# EAGLE schematic logic (EAGLE 9.6.2)
Assembly variants: basic

## Sheet 1 of 3: MCU
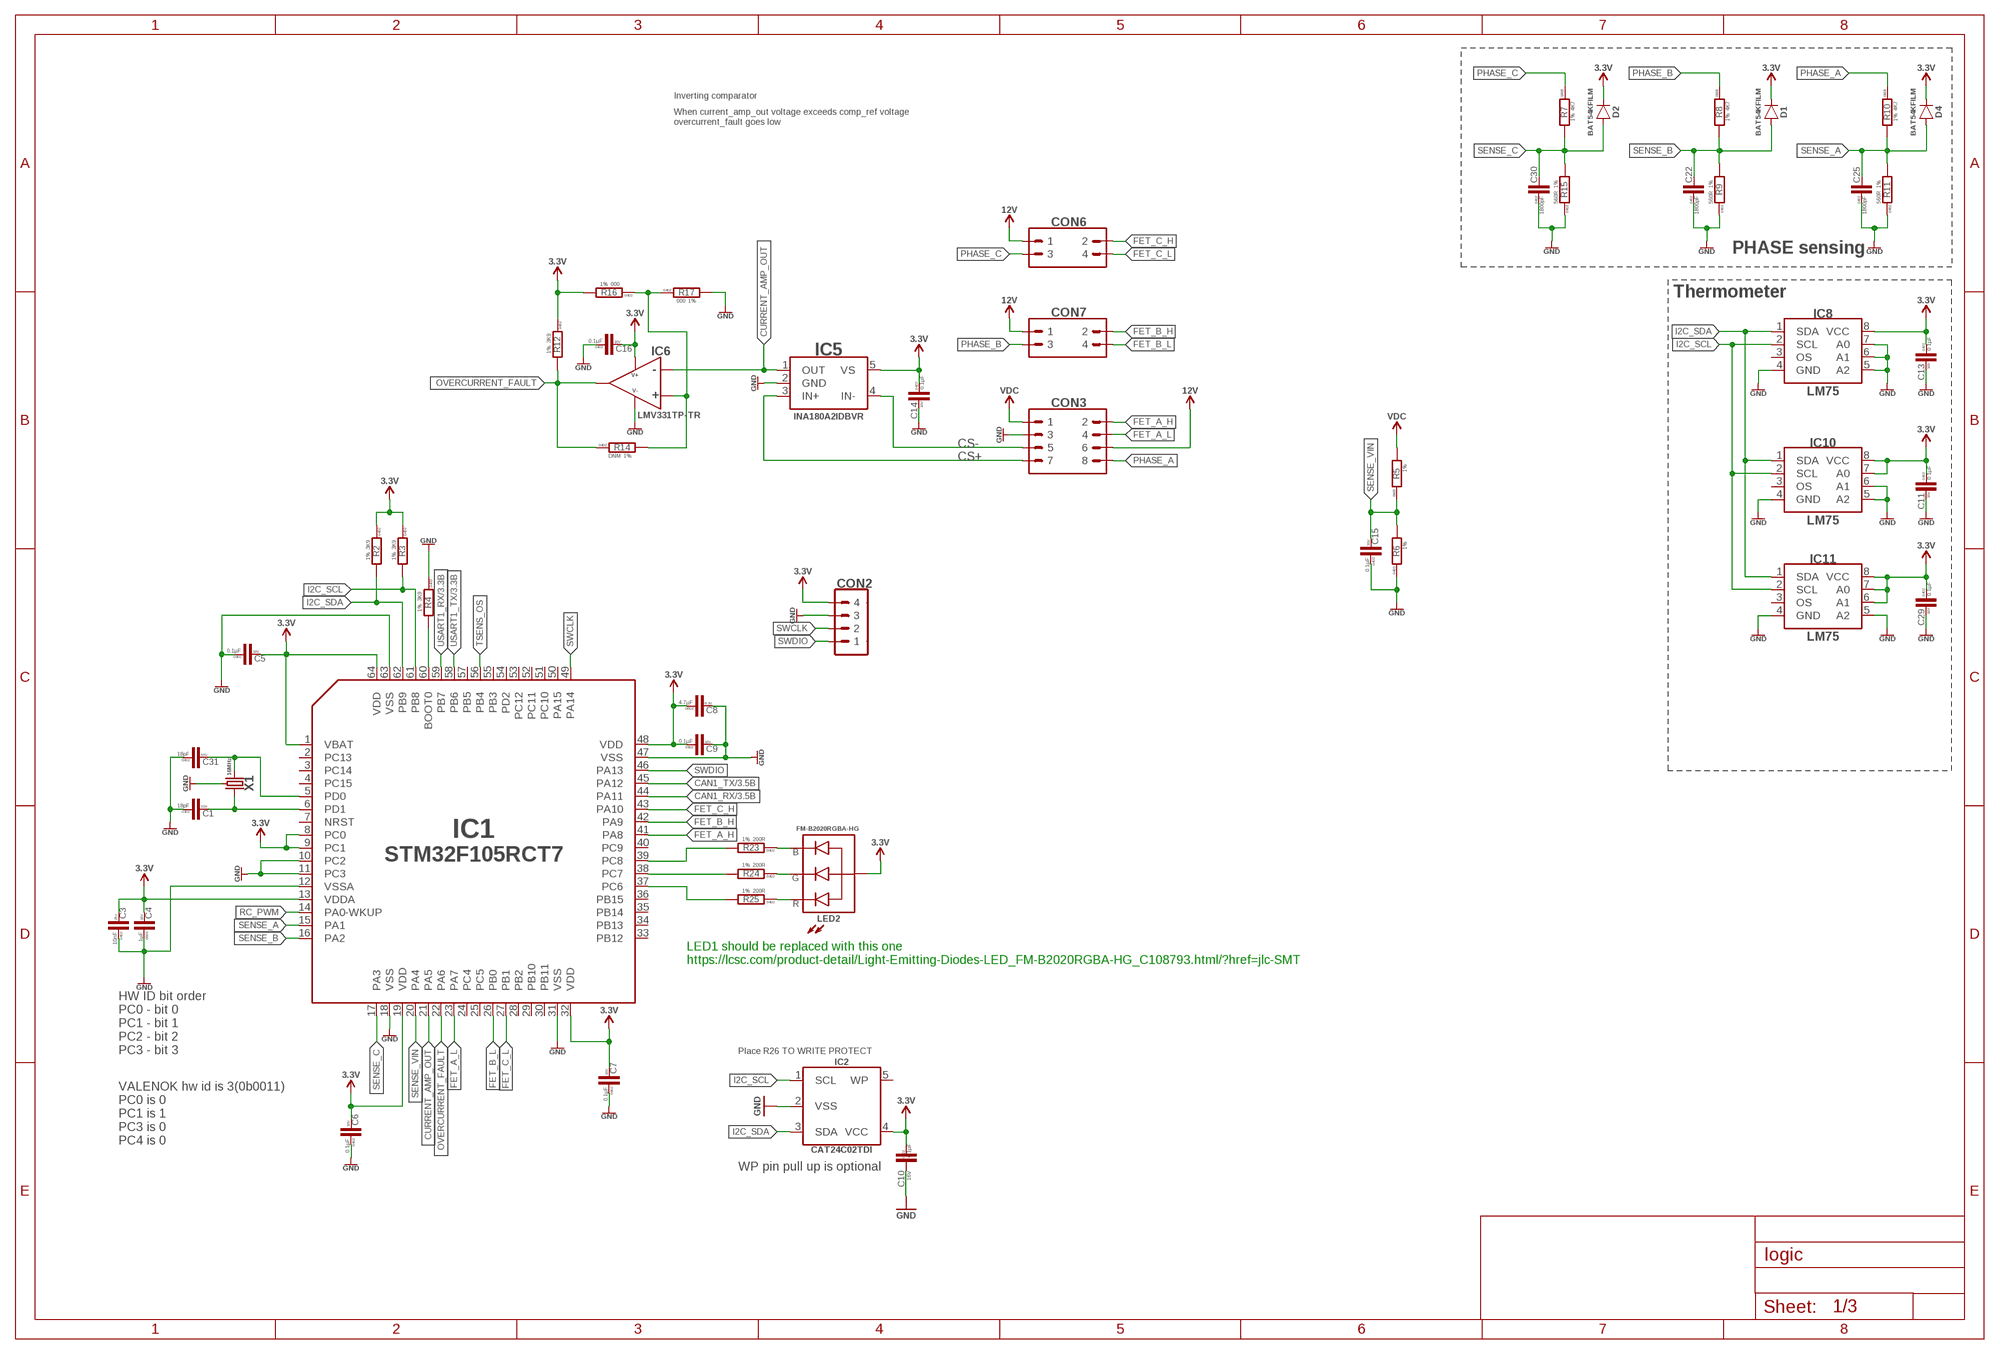
[diagram p0: schematic, sheet 1]

### Parts
C1  18pF  C-0402  [C0402]
C3  10nF  C-0402  [C0402]
C4  1µF  C-0603  [C0603]
C5  0.1µF  C-0402  [C0402]
C6  0.1µF  C-0402  [C0402]
C7  0.1µF  C-0402  [C0402]
C8  4.7µF  C-0603  [C0603]
C9  0.1µF  C-0402  [C0402]
C10  0.1µF  0.1µF-16V_10%_X7R-0402  [C0402]
C11  0.1µF  C-0402  [C0402]
C13  0.1µF  C-0402  [C0402]
C14  0.1µF  C-0402  [C0402]
C15  0.1µF  C-0402  [C0402]
C16  0.1µF  C-0402  [C0402]
C22  1800pF  C-0402  [C0402]
C25  1800pF  C-0402  [C0402]
C29  0.1µF  C-0402  [C0402]
C30  1800pF  C-0402  [C0402]
C31  18pF  C-0402  [C0402]
CON2  PINHEAD_1X04-2.54  [1X04-PTH-2.54]
CON3  PINHEAD_2X04-PLS-2  [2X04-PTH-2]
CON6  PINHEAD_2X02-PTH-2-MALE  [2X02-PTH-2]  (not fitted in variant basic)
CON7  PINHEAD_2X02-PTH-2-MALE  [2X02-PTH-2]  (not fitted in variant basic)
D1  BAT54KFILM  [SOD523]
D2  BAT54KFILM  [SOD523]
D4  BAT54KFILM  [SOD523]
IC1  STM32F105RCT6  [TQFP64]
IC2  CAT24C02  [SOT23-5L]
IC5  INA180A2  [SOT23-5]
IC6  LMV331  [SOT23-5L]
IC8  LM75-TSSOP8  [TSSOP8]
IC10  LM75-TSSOP8  [TSSOP8]
IC11  LM75-TSSOP8  [TSSOP8]
LED2  LED_RGB-2020  [LED2020]
R2  3K9  R-1%-0402  [R0402]
R3  3K9  R-1%-0402  [R0402]
R4  3K9  R-1%-0402  [R0402]
R5  R-1%-0805  [R0805]
R6  R-1%-0402  [R0402]
R7  4K7  R-1%-0805  [R0805]
R8  4K7  R-1%-0805  [R0805]
R9  560R  R-1%-0402  [R0402]
R10  4K7  R-1%-0805  [R0805]
R11  560R  R-1%-0402  [R0402]
R12  3K9  R-1%-0402  [R0402]
R14  DNM  R-1%-0402  [R0402]
R15  560R  R-1%-0402  [R0402]
R16  000  R-1%-0402  [R0402]
R17  000  R-1%-0402  [R0402]
R23  200R  R-1%-0402  [R0402]
R24  200R  R-1%-0402  [R0402]
R25  200R  R-1%-0402  [R0402]
X1  16MHz  CRYSTAL-4P-16MHZ-3.2X2.5  [OSCILLATOR-3.2X2.5-4P]

### Nets
BOOT0: IC1.60(BOOT0) R4.2
CAN1_RX: IC1.44(PA11) ; also sheet 3
CAN1_TX: IC1.45(PA12) ; also sheet 3
CS+: CON3.7 IC5.3(IN+)
CS-: CON3.5 IC5.4(IN-)
CURRENT_AMP_OUT: IC1.21(PA5) IC5.1(OUT) IC6.3(IN-)
FET_A_H: CON3.2 IC1.41(PA8)
FET_A_L: CON3.4 IC1.23(PA7)
FET_B_H: CON7.2 IC1.42(PA9)
FET_B_L: CON7.4 IC1.26(PB0)
FET_C_H: CON6.2 IC1.43(PA10)
FET_C_L: CON6.4 IC1.27(PB1)
GND: C1.1 C3.1 C4.1 C5.1 C6.1 C7.1 C8.2 C9.2 C10.2 C11.2 C13.2 C14.2 C15.1 C16.1 C22.1 C25.1 C29.2 C30.1 C31.1 CON2.3 CON3.3 IC1.10(PC2) IC1.11(PC3) IC1.12(VSSA) IC1.18(VSS) IC1.31(VSS) IC1.47(VSS) IC1.63(VSS) IC2.2(VSS) IC5.2(GND) IC6.2(V-) IC8.4(GND) IC8.5(A2) IC8.6(A1) IC8.7(A0) IC10.4(GND) IC10.5(A2) IC10.6(A1) IC11.4(GND) IC11.5(A2) R4.1 R6.1 R9.1 R11.1 R15.1 R17.2 X1.2(GND) X1.4(GND) ; also sheet 2,3
I2C_SCL: IC1.61(PB8) IC2.1(SCL) IC8.2(SCL) IC10.2(SCL) IC11.2(SCL) R3.2
I2C_SDA: IC1.62(PB9) IC2.3(SDA) IC8.1(SDA) IC10.1(SDA) IC11.1(SDA) R2.2
N$2: IC6.1(IN+) R14.2 R16.1 R17.1
N$3: IC1.37(PC6) R25.2
N$6: LED2.B R23.1
N$7: LED2.R R25.1
N$12: IC1.38(PC7) R24.2
N$16: C31.2 IC1.5(PD0) X1.3
N$18: IC1.39(PC8) R23.2
N$21: C1.2 IC1.6(PD1) X1.1
N$26: LED2.G R24.1
OVERCURRENT_FAULT: IC1.22(PA6) IC6.4(OUT) R12.2 R14.1
PHASE_A [HV]: CON3.8 R10.1
PHASE_B [HV]: CON7.3 R8.1
PHASE_C [HV]: CON6.3 R7.1
RC_PWM: IC1.14(PA0-WKUP)
SENSE_A: C25.2 D4.A IC1.15(PA1) R10.2 R11.2
SENSE_B: C22.2 D1.A IC1.16(PA2) R8.2 R9.2
SENSE_C: C30.2 D2.A IC1.17(PA3) R7.2 R15.2
SENSE_VIN: C15.2 IC1.20(PA4) R5.1 R6.2
SWCLK: CON2.2 IC1.49(PA14)
SWDIO: CON2.1 IC1.46(PA13)
TSENS_OS: IC1.56(PB4)
USART1_RX: IC1.59(PB7) ; also sheet 3
USART1_TX: IC1.58(PB6) ; also sheet 3
VDC [HV]: CON3.1 R5.2 ; also sheet 2
VDD_3V3: C3.2 C4.2 C5.2 C6.2 C7.2 C8.1 C9.1 C10.1 C11.1 C13.1 C14.1 C16.2 C29.1 CON2.4 D1.C D2.C D4.C IC1.1(VBAT) IC1.8(PC0) IC1.9(PC1) IC1.13(VDDA) IC1.19(VDD) IC1.32(VDD) IC1.48(VDD) IC1.64(VDD) IC2.4(VCC) IC5.5(VS) IC6.5(V+) IC8.8(VCC) IC10.7(A0) IC10.8(VCC) IC11.6(A1) IC11.7(A0) IC11.8(VCC) LED2.+(A) R2.1 R3.1 R12.1 R16.2 ; supply symbol labelled 3.3V ; also sheet 2,3
VDD_12V: CON3.6 CON6.1 CON7.1 ; supply symbol labelled 12V ; also sheet 2
Unconnected: IC1.2(PC13) IC1.3(PC14) IC1.4(PC15) IC1.7(NRST) IC1.24(PC4) IC1.25(PC5) IC1.28(PB2) IC1.29(PB10) IC1.30(PB11) IC1.33(PB12) IC1.34(PB13) IC1.35(PB14) IC1.36(PB15) IC1.40(PC9) IC1.50(PA15) IC1.51(PC10) IC1.52(PC11) IC1.53(PC12) IC1.54(PD2) IC1.55(PB3) IC1.57(PB5) IC2.5(WP) IC8.3(OS) IC10.3(OS) IC11.3(OS)

### Notes on the sheet
- Inverting comparator
- When current_amp_out voltage exceeds comp_ref voltage 
  overcurrent_fault goes low
- PHASE sensing
- Thermometer
- LED1 should be replaced with this one
  https://lcsc.com/product-detail/Light-Emitting-Diodes-LED_FM-B2020RGBA-HG_C108793.html/?href=jlc-SMT
- HW ID bit order
  PC0 - bit 0
  PC1 - bit 1
  PC2 - bit 2
  PC3 - bit 3
- Place R26 TO WRITE PROTECT
- VALENOK hw id is 3(0b0011)
  PC0 is 0
  PC1 is 1
  PC3 is 0
  PC4 is 0
- WP pin pull up is optional

## Sheet 2 of 3: Power
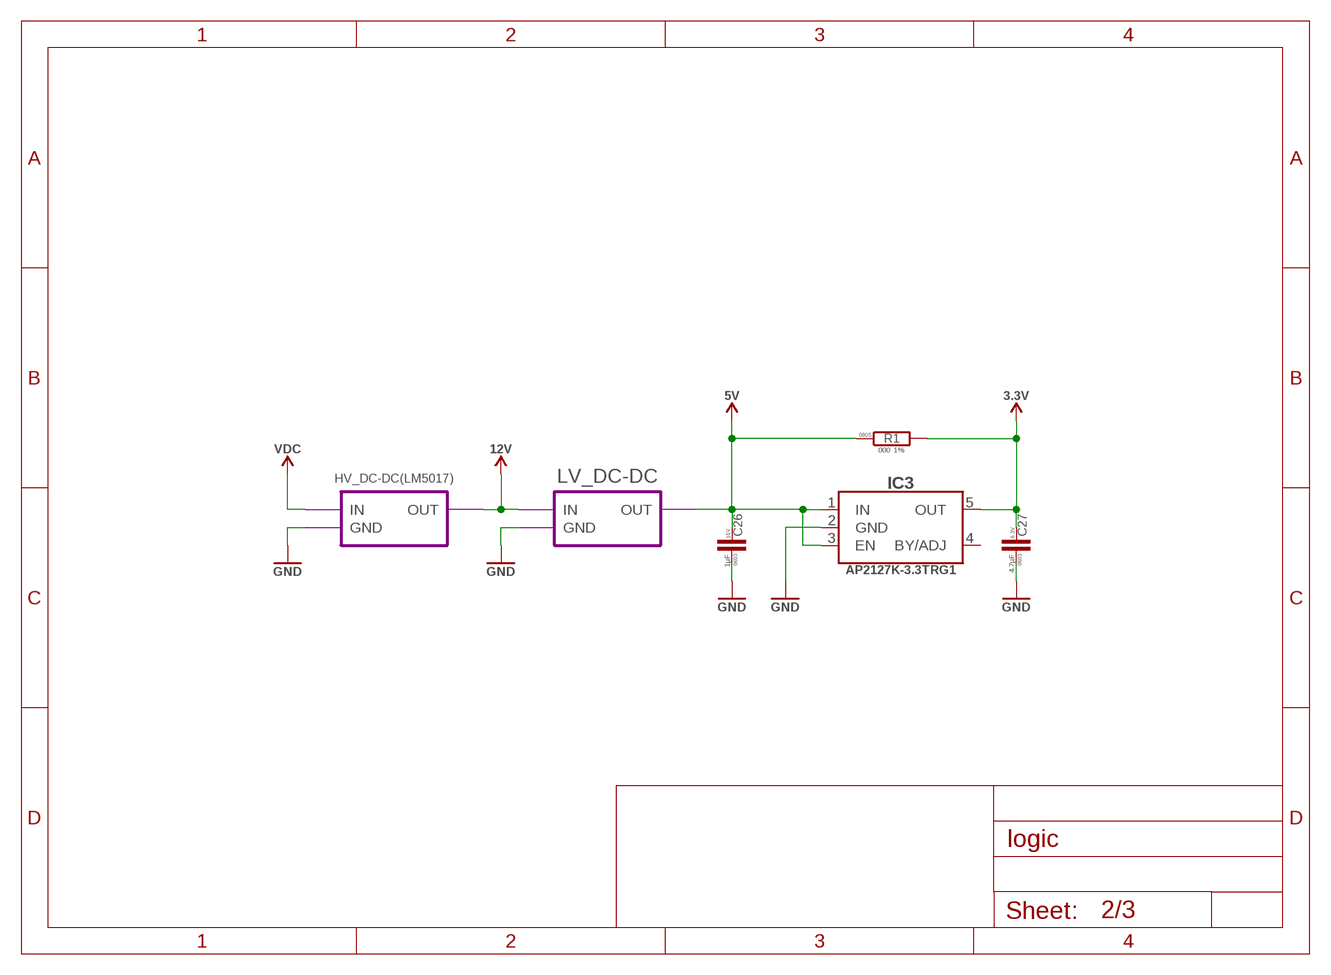
[diagram p1: schematic, sheet 2]

### Parts
C26  1µF  C-0603  [C0603]
C27  4.7µF  C-0603  [C0603]
IC3  AP2127-3.3  [SOT23-5]
R1  000  R-1%-0805  [R0805]

### Module instances
HV_DC-DC(LM5017) = HV_DC-DC(LM5017) (part numbers offset by 100)
LV_DC-DC = LV_DC-DC (part numbers offset by 200)

### Nets
GND: C26.1 C27.1 IC3.2(GND) ; port LV_DC-DC.GND HV_DC-DC(LM5017).GND ; also sheet 1,3
VDC [HV]: port HV_DC-DC(LM5017).IN ; also sheet 1
VDD_3V3: C27.2 IC3.5(OUT) R1.2 ; supply symbol labelled 3.3V ; also sheet 1,3
VDD_5V: C26.2 IC3.1(IN) IC3.3(EN) R1.1 ; port LV_DC-DC.OUT ; supply symbol labelled 5V
VDD_12V: port LV_DC-DC.IN HV_DC-DC(LM5017).OUT ; supply symbol labelled 12V ; also sheet 1
Unconnected: IC3.4(BY/ADJ)

## Sheet 3 of 3: Interfaces
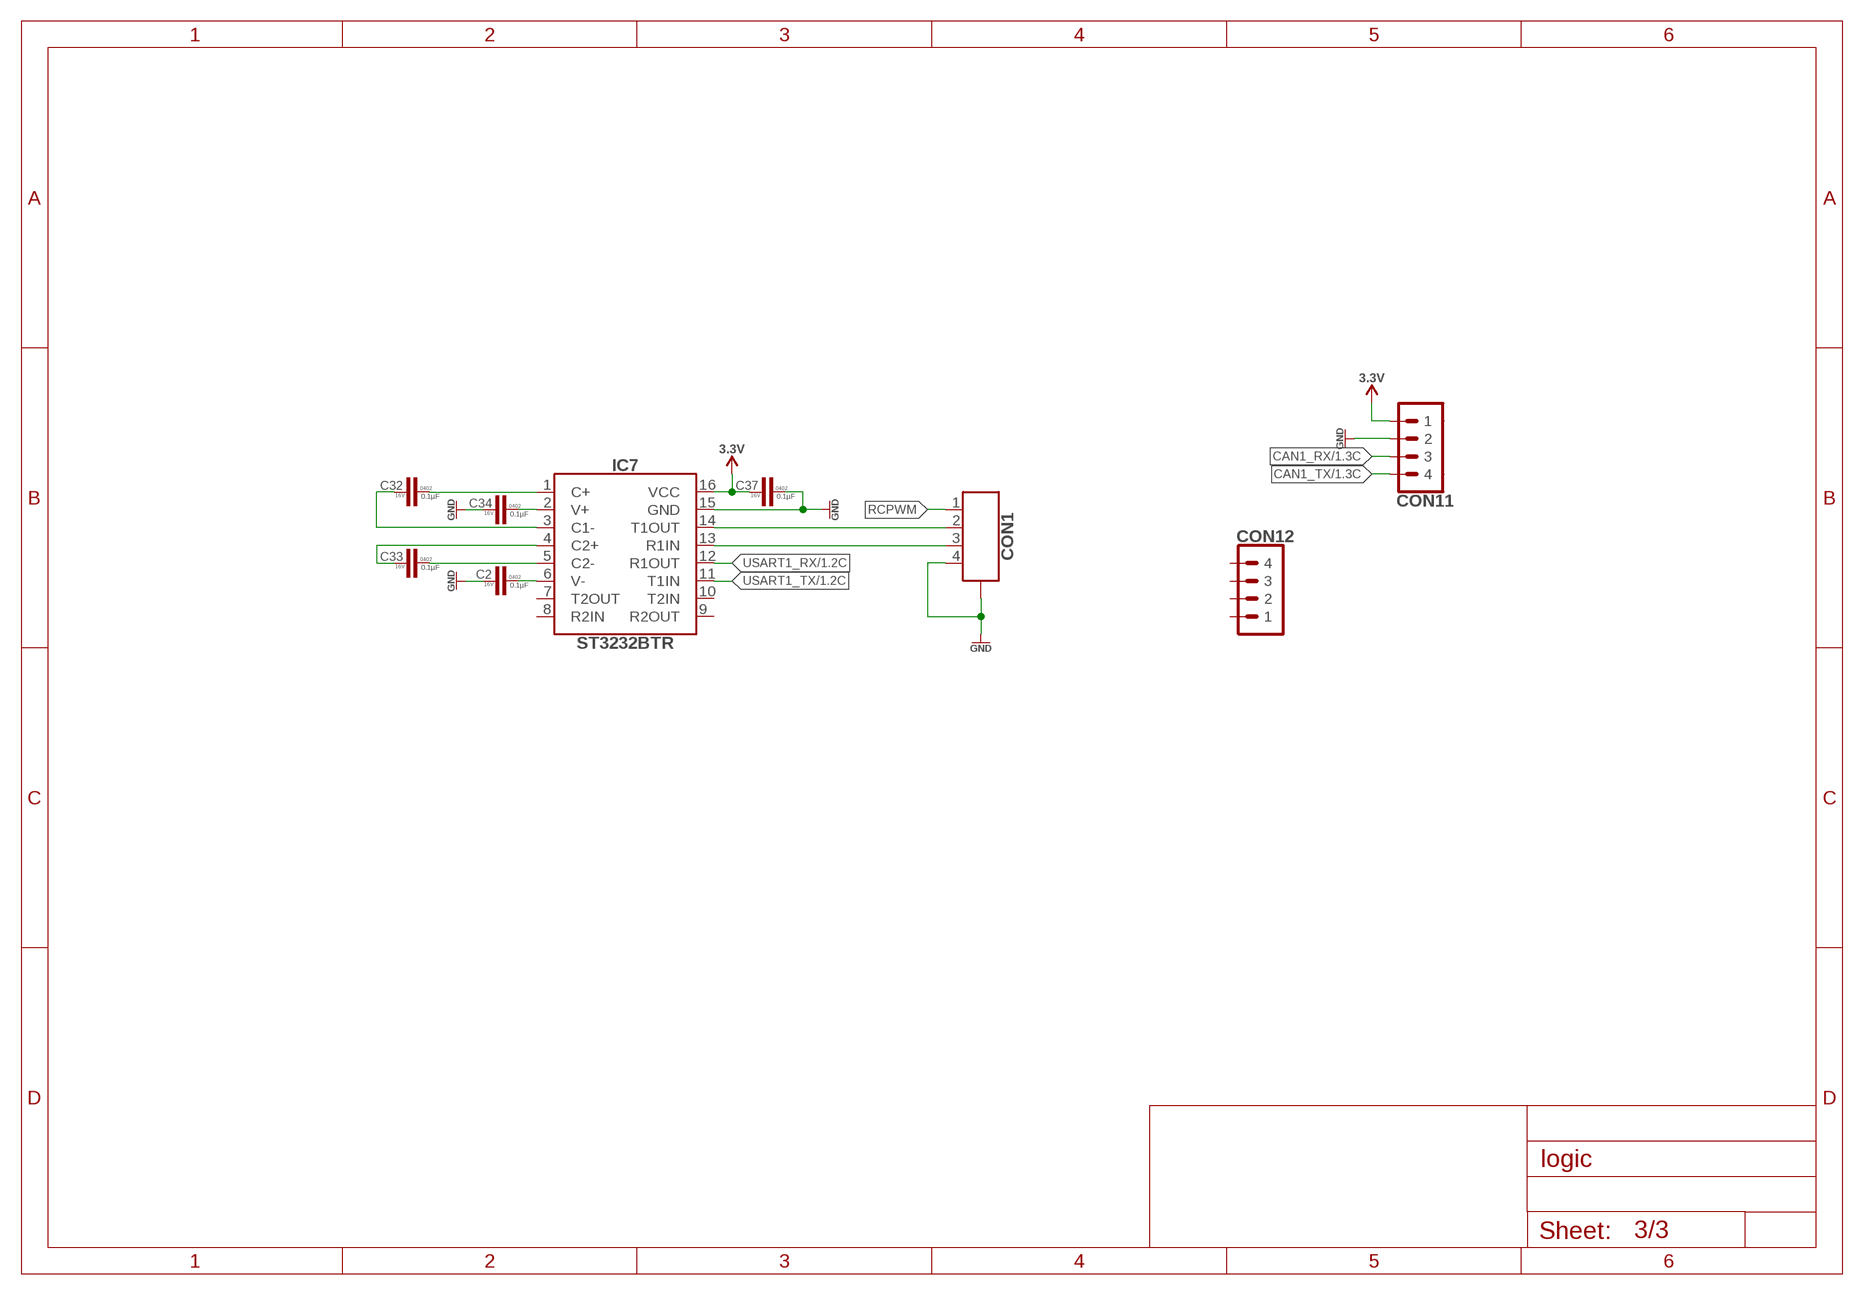
[diagram p2: schematic, sheet 3]

### Parts
C2  0.1µF  C-0402  [C0402]
C32  0.1µF  C-0402  [C0402]
C33  0.1µF  C-0402  [C0402]
C34  0.1µF  C-0402  [C0402]
C37  0.1µF  C-0402  [C0402]
CON1  CON-4P-TABS-JST_GH-RA  [JST_GH-4P-RA]
CON11  PINHEAD_1X04-2  [1X04-PTH-2]
CON12  PINHEAD_1X04-2  [1X04-PTH-2]
IC7  ST3232  [TSSOP16]

### Nets
CAN1_RX: CON11.3 ; also sheet 1
CAN1_TX: CON11.4 ; also sheet 1
GND: C2.2 C34.2 C37.1 CON1.4 CON1.M$0(GND) CON1.M$1(GND) CON11.2 IC7.15(GND) ; also sheet 1,2
N$19: C32.1 IC7.1(C+)
N$20: C32.2 IC7.3(C1-)
N$22: C33.1 IC7.5(C2-)
N$24: C33.2 IC7.4(C2+)
N$27: C2.1 IC7.6(V-)
N$28: C34.1 IC7.2(V+)
N$29: CON1.3 IC7.13(R1IN)
N$30: CON1.2 IC7.14(T1OUT)
RCPWM: CON1.1
USART1_RX: IC7.12(R1OUT) ; also sheet 1
USART1_TX: IC7.11(T1IN) ; also sheet 1
VDD_3V3: C37.2 CON11.1 IC7.16(VCC) ; supply symbol labelled 3.3V ; also sheet 1,2
Unconnected: CON12.1 CON12.2 CON12.3 CON12.4 IC7.7(T2OUT) IC7.8(R2IN) IC7.9(R2OUT) IC7.10(T2IN)

## Library data of the parts
C1 C31 = rc:C; AEC-Q: ---; DIGIKEY#: 399-8828-1-ND; MANF: Kemet; MANF#: CBR04C180F5GAC; OPERATING_TEMP: -55°C ~ 125°C; PACKAGE: 0402; VOLTAGE: 50V
C2 C5-C7 C9 C11 C13-C16 C29 C32-C34 C37 = rc:C; AEC-Q: ---; DIGIKEY#: 490-3261-1-ND; MANF: Murata Electronics; MANF#: GRM155R71C104KA88D; OPERATING_TEMP: -55°C ~ 125°C; PACKAGE: 0402; VOLTAGE: 16V
C3 = rc:C; AEC-Q: ---; DIGIKEY#: 490-6043-1-ND; MANF: Murata Electronics; MANF#: GCM155R71E103KA37D; OPERATING_TEMP: -55°C ~ 125°C; PACKAGE: 0402; VOLTAGE: 25V
C4 C26 = rc:C; AEC-Q: AEC-Q200; DIGIKEY#: 445-12539-1-ND; MANF: TDK Corporation; MANF#: CGA3E1X7R1C105K080AC; OPERATING_TEMP: -55°C ~ 125°C; PACKAGE: 0603; VOLTAGE: 16V
C8 C27 = rc:C; AEC-Q: ---; DIGIKEY#: 1276-2087-1-ND; MANF: Samsung Electro-Mechanics; MANF#: CL10B475KQ8NQNC; OPERATING_TEMP: -55°C ~ 125°C; PACKAGE: 0603; VOLTAGE: 6.3V
C10 = C_digikey:0.1µF; DIGIKEY#: 490-3261-1-ND; MANF: Murata Electronics North America; MANF#: GRM155R71C104KA88D; OPERATING_TEMP: -55°C ~ 125°C; PACKAGE: 0402; TC: X7R; TOLERANCE: +-10%; VOLTAGE: 16V
C22 C25 C30 = rc:C; PACKAGE: 0402
CON1 = Connectors:CON-4P-TABS: Connector Receptacle 4 Position 0.049" (1.25mm) Tin Surface Mount; DIGIKEY#: 455-1566-1-ND; MANF: JST Sales America Inc; MANF#: SM04B-GHS-TB(LF)(SN)
CON2 CON11 CON12 = pinhead:PINHEAD_1X04
CON3 = pinhead:PINHEAD_2X04
CON6 CON7 = pinhead:PINHEAD_2X02
D1 D2 D4 = Diodes:BAT54KFILM: Diode Schottky 40V, 300mA (DC) Surface Mount SOD-523; DIGIKEY#: STMicroelectronics; LCSC#: C283259; MANF: STMicroelectronics; MANF#: BAT54KFILM
IC1 = stm32:STM32F105RCT6: ARM® Cortex®-M3 STM32F1 Microcontroller IC 32-Bit 72MHz 256KB (256K x 8) FLASH; DIGIKEY#: 497-11547-ND; LCSC#: C8345; MANF: STMicroelectronics; MANF#: STM32F105RCT7; OPERATING_TEMP: -40°C ~ 105°C (TA)
IC2 = misc:CAT24C02: IC EEPROM 2KBIT 400KHZ TSOT23-5; DIGIKEY#: CAT24C02TDI-GT3AOSCT-ND; MANF: ON Semiconductor; MANF#: CAT24C02TDI-GT3A
IC3 = linear regulators:AP2127: IC REG LINEAR 3.3V 300MA SOT23-5; DIGIKEY#: AP2127K-3.3TRG1DITR-ND; I_MAX: 300mA; LCSC#: C156285; MANF: Diodes Incorporated; MANF#: AP2127K-3.3TRG1; V_MAX: 6V
IC5 = misc:INA180A: Current Sense Amplifier Circuit Rail-to-Rail SOT-23-5; DIGIKEY#: 296-47653-1-ND; GAIN: 50V/V; LCSC#: C192764; MANF: Texas Instruments; MANF#: INA180A2IDBVR
IC6 = misc:LMV331: Comparator General Purpose open drain SOT-23-5; LCSC#: C108095; MANF: 3PEAK; MANF#: LMV331TP-TR
IC7 = serial_interfaces:ST3232: 2/2 Transceiver Full RS232 16-TSSOP; DIGIKEY#: 497-6534-1-ND; LCSC#: C435947; MANF: STMicroelectronics; MANF#: ST3232BTR
IC8 IC10 IC11 = misc:LM75: SENSOR TEMPERATURE I2C 8TSSOP; DIGIKEY#: 568-4768-1-ND; LCSC#: C33099; MANF: NXP Semiconductors; MANF#: LM75BDP,118
LED2 = rc:LED_RGB; LCSC#: C108793; MANF: Foshan NationStar Optoelectronics; MANF#: FM-B2020RGBA-HG
R1 R5 R7 R8 R10 = rc:R; PACKAGE: 0805; TOLERANCE: 1%
R2-R4 R12 R14 R16 R17 = rc:R; AEC-Q: ---; DIGIKEY#: 311-3.90KLRCT-ND; MANF: Yageo; MANF#: RC0402FR-073K9L; OPERATING_TEMP: -55°C ~ 155°C; PACKAGE: 0402; TOLERANCE: 1%
R6 R9 R11 R15 = rc:R; PACKAGE: 0402; TOLERANCE: 1%
R23-R25 = rc:R; AEC-Q: ---; DIGIKEY#: 311-200JRCT-ND; MANF: Yageo; MANF#: RC0402JR-07200RL; OPERATING_TEMP: -55°C ~ 155°C; PACKAGE: 0402; TOLERANCE: 1%
X1 = crystal:CRYSTAL-4P: Smd Crystal; DIGIKEY#: 1253-1198-1-ND; MANF: AVX Corp/Kyocera Corp; MANF#: CX3225GB24000P0HPQCC

## Module HV_DC-DC(LM5017)
Ports: IN(pwr) GND(pwr) OUT(pwr)
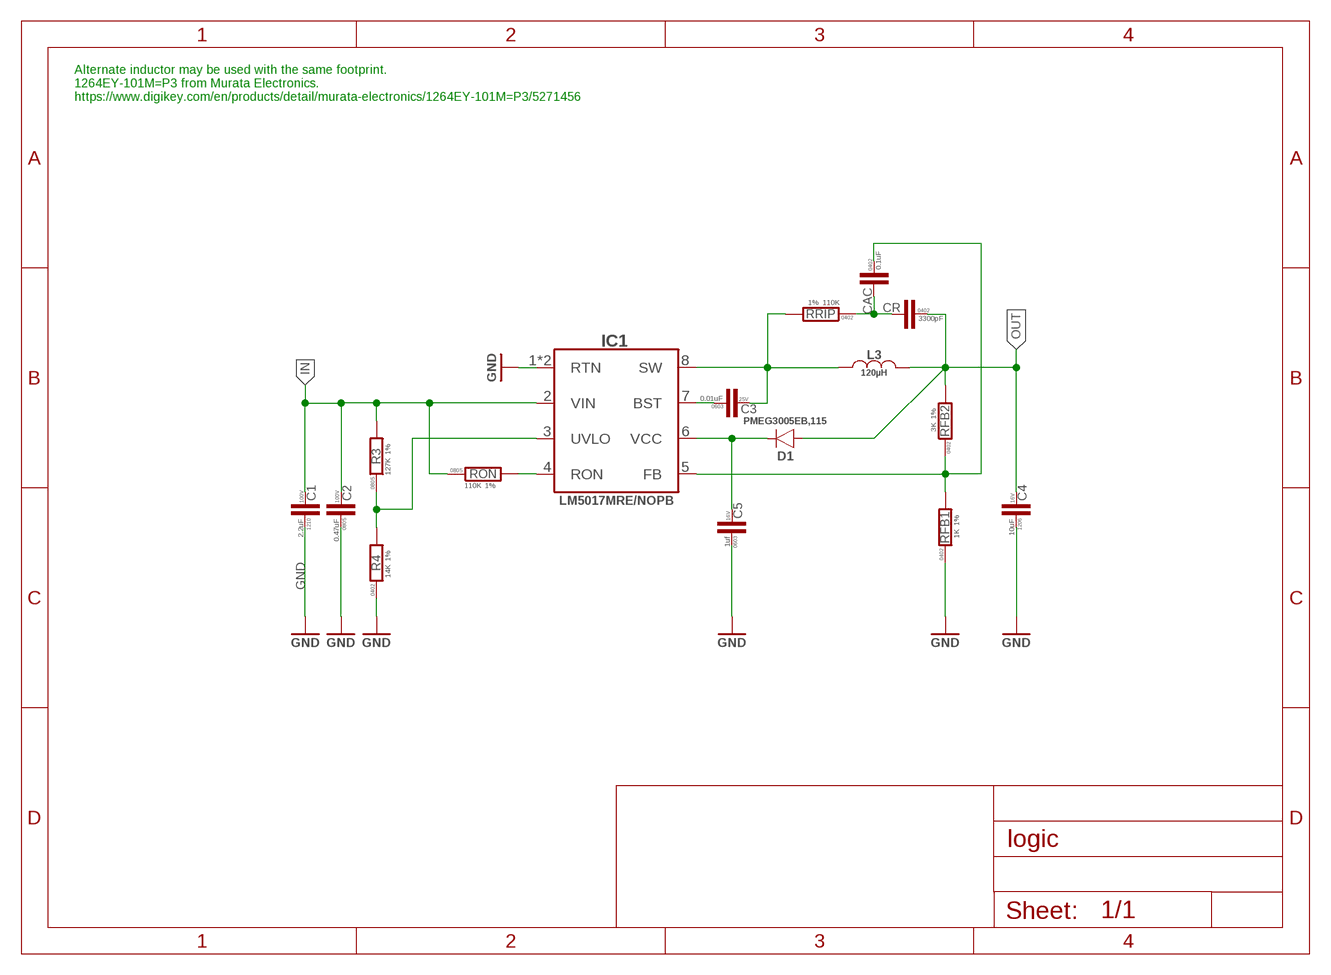
[diagram p3: schematic, module HV_DC-DC(LM5017), sheet 1]

### Parts
C1  2.2uF  C-1210  [C1210]
C2  0.47uF  C-0805  [C0805]
C3  0.01uF  C-0603  [C0603]
C4  10uF  C-1206  [C1206]
C5  1uf  C-0603  [C0603]
CAC  0.1uF  C-0402  [C0402]
CR  3300pF  C-0402  [C0402]
D1  PMEG3005  [SOD523]
IC1  LM5017  [SOIC8-POWERPAD]
L3  120µH  120µH-HPC8040F  [HPC8040NF]
R3  127K  R-1%-0805  [R0805]
R4  14K  R-1%-0402  [R0402]
RFB1  1K  R-1%-0402  [R0402]
RFB2  3K  R-1%-0402  [R0402]
RON  110K  R-1%-0805  [R0805]
RRIP  110K  R-1%-0402  [R0402]

### Nets
GND: C1.1 C2.1 C4.P$1 C5.1 IC1.1(RTN) IC1.P$1(RTN) R4.1 RFB1.1
IN: C1.2 C2.2 IC1.2(VIN) R3.2 RON.1
N$2: C3.2 IC1.8(SW) L3.1 RRIP.2
N$3: CAC.2 CR.2 RRIP.1
N$10: C5.2 D1.C IC1.6(VCC)
N$11: IC1.4(RON) RON.2
N$12: C3.1 IC1.7(BST)
N$14: CAC.1 IC1.5(FB) RFB1.2 RFB2.1
N$17: IC1.3(UVLO) R3.1 R4.2
OUT: C4.P$2 CR.1 D1.A L3.2 RFB2.2

### Notes on the sheet
- Alternate inductor may be used with the same footprint.
  1264EY-101M=P3 from Murata Electronics.
  https://www.digikey.com/en/products/detail/murata-electronics/1264EY-101M=P3/5271456

### Library data of the parts
C1 = rc:C; PACKAGE: 1210; VOLTAGE: 100V
C2 = rc:C; PACKAGE: 0805; VOLTAGE: 100V
C3 = rc:C; PACKAGE: 0603; VOLTAGE: 25V
C4 = rc:C; PACKAGE: 1206; VOLTAGE: 16V
C5 = rc:C; PACKAGE: 0603; VOLTAGE: 16V
CAC CR = rc:C; PACKAGE: 0402
D1 = Diodes:PMEG3005: Diode Schottky 30V 500mA (DC) Surface Mount SOD-523; DIGIKEY#: 1727-5831-1-ND; MANF: Nexperia USA Inc; MANF#: PMEG3005EB,115
IC1 = dc-dc:LM5017: Buck Switching Regulator IC Positive Adjustable 1.225V 1 Output 600mA 8-PowerSOIC (0.154", 3.90mm Width); DIGIKEY#: 296-37695-1-ND; DIGIREEL#: 296-37695-6-ND; LCSC#: C34355; MANF: Texas Instruments; MANF#: LM5017MRE/NOPB
L3 = power_inductors:120µH; CURRENT: 1A; DCR: 350mΩ; HEIGHT: 3.7mm; LCSC#: C357080; MANF: TAI-TECH; MANF#: HPC8040NF-121M
R3 RON = rc:R; PACKAGE: 0805; TOLERANCE: 1%
R4 RFB1 RFB2 RRIP = rc:R; PACKAGE: 0402; TOLERANCE: 1%

## Module LV_DC-DC
Ports: IN(pwr) GND(pwr) OUT(pwr)
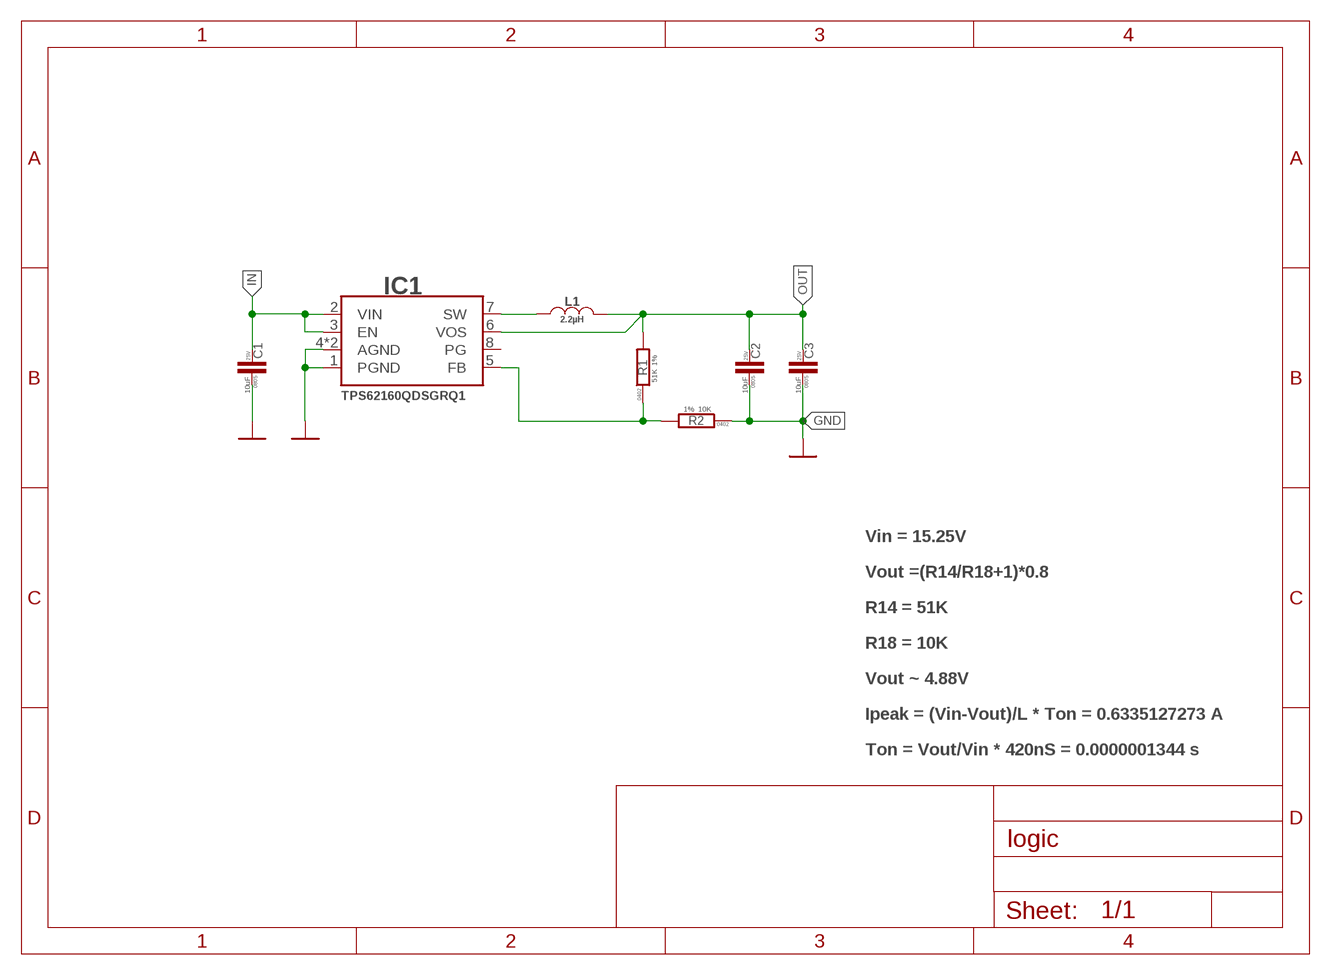
[diagram p4: schematic, module LV_DC-DC, sheet 1]

### Parts
C1  10uF  C-0805  [C0805]
C2  10uF  C-0805  [C0805]
C3  10uF  C-0805  [C0805]
IC1  TPS62160QDSGRQ1  [WFDFN-8]
L1  2.2µH  2.2µH-NRS3015  [NR3015]
R1  51K  R-1%-0402  [R0402]
R2  10K  R-1%-0402  [R0402]

### Nets
FB: IC1.5(FB) R1.1 R2.2
GND: C1.1 C2.1 C3.1 IC1.1(PGND) IC1.4(AGND) IC1.EP(AGND) R2.1
IN: C1.2 IC1.2(VIN) IC1.3(EN)
N$1: IC1.7(SW) L1.1
OUT: C2.2 C3.2 IC1.6(VOS) L1.2 R1.2
Unconnected: IC1.8(PG)

### Notes on the sheet
- Vin = 15.25V
- Vout =(R14/R18+1)*0.8
- R14 = 51K
- R18 = 10K
- Vout ~ 4.88V
- Ipeak = (Vin-Vout)/L * Ton = 0.6335127273 A
- Ton = Vout/Vin * 420nS = 0.0000001344 s

### Library data of the parts
C1-C3 = rc:C; AEC-Q: AEC-Q200; DIGIKEY#: 445-181411-1-ND; MANF: TDK Corporation; MANF#: CGA4J1X7S1E106K125AE; PACKAGE: 0805; VOLTAGE: 25V
IC1 = dc-dc:TPS62160QDSGRQ1: Buck Switching Regulator IC Positive Adjustable 0.9V 1 Output 1A 8-WFDFN Exposed Pad; AEC-Q: AEC-Q100; DIGIKEY#: 296-40840-1-ND; LCSC#: C324077; MANF: Texas Instruments; MANF#: TPS62160QDSGRQ1
L1 = power_inductors:2.2µH; AEC-Q: AEC-Q200; CURRENT: 1.5A; DIGIKEY#: 587-3561-1-ND; HEIGHT: 1.5mm; MANF: Taiyo Yuden; MANF#: NRS3015T2R2MNGHV
R1 = rc:R; AEC-Q: AEC-Q200; DIGIKEY#: P51.0KLCT-ND; MANF: Panasonic Electronic Components; MANF#: ERJ-2RKF5102X; PACKAGE: 0402; TOLERANCE: 1%
R2 = rc:R; AEC-Q: AEC-Q200; DIGIKEY#: P10.0KLCT-ND; MANF: Panasonic Electronic Components; MANF#: ERJ-2RKF1002X; PACKAGE: 0402; TOLERANCE: 1%

## Net classes
1 HV: clearance 0.5 mm